# EAGLE design mae_radio_V14.05.14 (EAGLE 5.01)
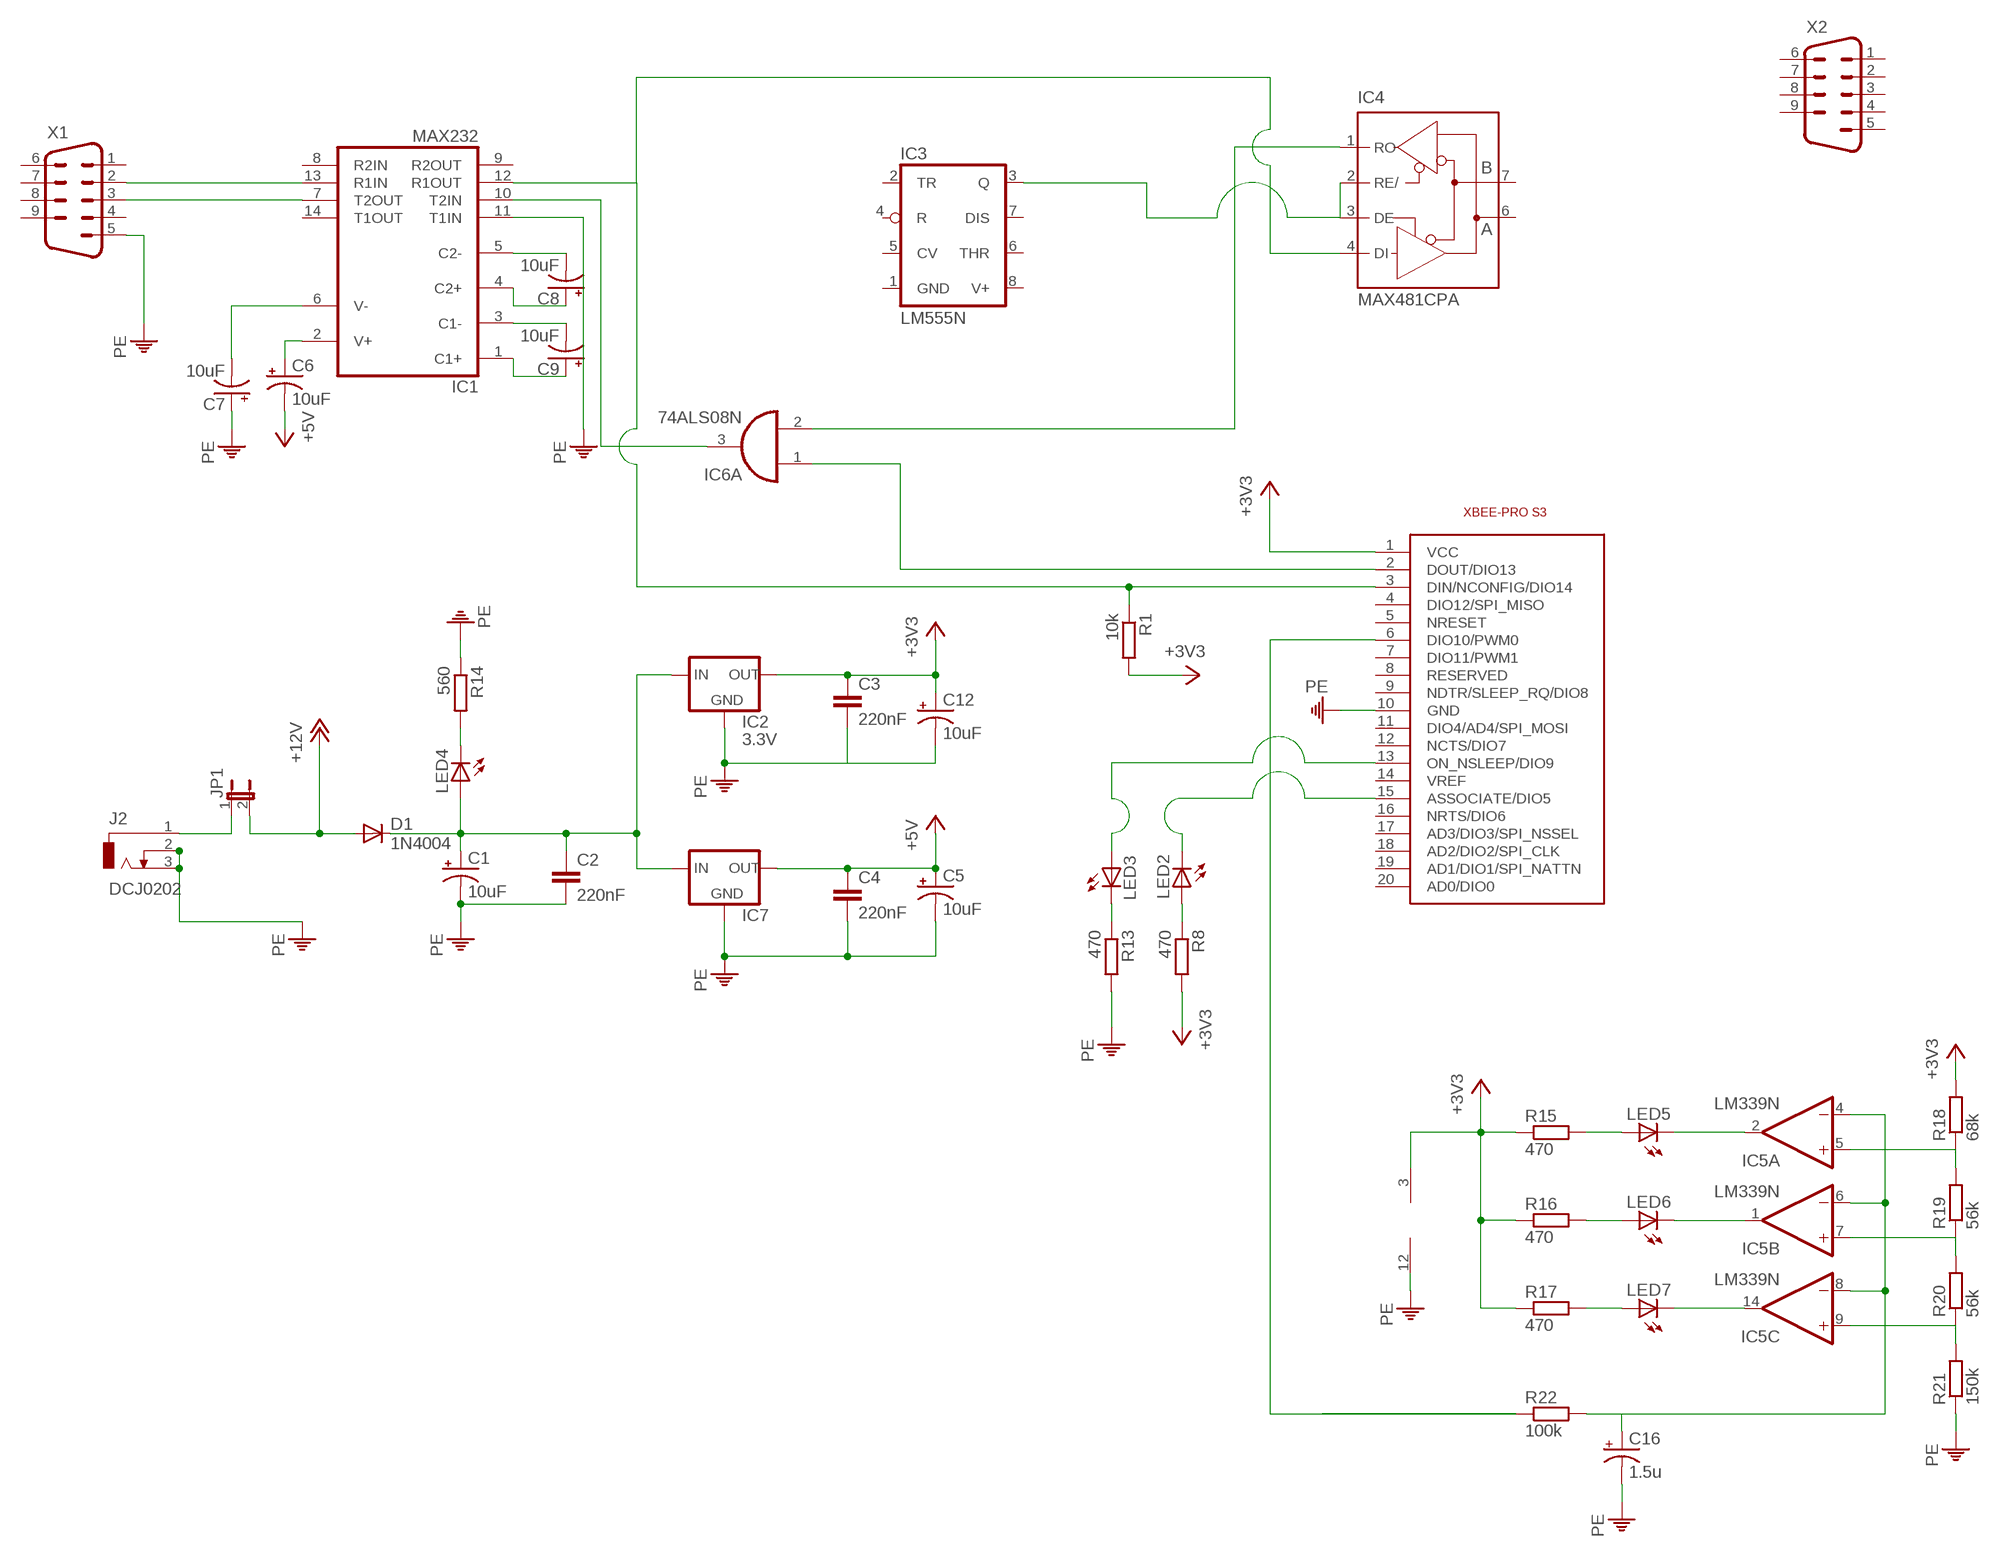
[diagram p0: schematic, sheet 1]

## Parts
C1  10uF  CPOL-USE2-5  [E2-5]
C2  220nF  C5/3.5  [C5B3.5]
C3  220nF  C5/3.5  [C5B3.5]
C4  220nF  C5/3.5  [C5B3.5]
C5  10uF  CPOL-USE2-5  [E2-5]
C6  10uF  CPOL-USE2-5  [E2-5]
C7  10uF  CPOL-USE2-5  [E2-5]
C8  10uF  CPOL-USE2-5  [E2-5]
C9  10uF  CPOL-USE2-5  [E2-5]
C12  10uF  CPOL-USE2-5  [E2-5]
C16  1.5u  CPOL-USE2-5  [E2-5]
D1  1N4004  [DO41-10]
IC1  MAX232  [DIL16]
IC2  3.3V  78XXL  [78XXL]
IC3  LM555N  [DIL08]
IC4  MAX481CPA  [DIL08]
IC5  LM339N  [DIL14]
IC6  74ALS08N  [DIL14]
IC7  78XXL  [78XXL]
J2  DCJ0202  [DCJ0202]
JP1  JP1E  [JP1]
LED2  LED3MM  [LED3MM]
LED3  LED3MM  [LED3MM]
LED4  LED5MM  [LED5MM]
LED5  LED3MM  [LED3MM]
LED6  LED3MM  [LED3MM]
LED7  LED3MM  [LED3MM]
R1  10k  R-EU_0207/7  [0207/7]
R8  470  R-EU_0207/7  [0207/7]
R13  470  R-EU_0207/7  [0207/7]
R14  560  R-EU_0207/7  [0207/7]
R15  470  R-EU_0207/7  [0207/7]
R16  470  R-EU_0207/7  [0207/7]
R17  470  R-EU_0207/7  [0207/7]
R18  68k  R-EU_0207/7  [0207/7]
R19  56k  R-EU_0207/7  [0207/7]
R20  56k  R-EU_0207/7  [0207/7]
R21  150k  R-EU_0207/7  [0207/7]
R22  100k  R-EU_0207/7  [0207/7]
U$1  XBEEPRO900  [XBEE-PRO]
X1  M09HP  [M09HP]
X2  M09HP  [M09HP]

## Nets
+3V3: C3.1 C12.+ IC2.OUT IC5.3(P:V+) R1.2 R8.2 R15.1 R16.1 R17.1 R18.2 U$1.1(VCC)
+5V: C4.1 C5.+ C6.- IC7.OUT
+12V: D1.A JP1.2
DIN: IC1.12(R1OUT) IC4.4(DI) R1.1 U$1.3(DIN/NCONFIG/DIO14)
DOUT: IC6.1(A:I0) U$1.2(DOUT/DIO13)
N$1: J2.1 JP1.1
N$2: C1.+ C2.1 D1.C IC2.IN IC7.IN LED4.A
N$3: C9.+ IC1.1(C1+)
N$4: IC1.10(T2IN) IC6.3(A:O)
N$5: IC4.1(RO) IC6.2(A:I1)
N$6: C9.- IC1.3(C1-)
N$7: C8.+ IC1.4(C2+)
N$8: LED3.A U$1.13(ON_NSLEEP/DIO9)
N$9: R22.1 U$1.6(DIO10/PWM0)
N$10: IC3.3(Q) IC4.2(RE/) IC4.3(DE)
N$11: LED2.A R8.1
N$12: C8.- IC1.5(C2-)
N$13: IC1.13(R1IN) X1.2
N$14: LED3.K(C) R13.1
N$15: LED4.K(C) R14.2
N$16: LED2.K(C) U$1.15(ASSOCIATE/DIO5)
N$17: IC1.7(T2OUT) X1.3
N$18: C7.- IC1.6(V-)
N$19: C6.+ IC1.2(V+)
N$24: IC5.2(A:OUT) LED5.K(C)
N$25: IC5.1(B:OUT) LED6.K(C)
N$26: IC5.14(C:OUT) LED7.K(C)
N$27: LED7.A R17.2
N$28: LED6.A R16.2
N$29: LED5.A R15.2
N$30: IC5.5(A:+IN) R18.1 R19.2
N$31: IC5.7(B:+IN) R19.1 R20.2
N$32: IC5.9(C:+IN) R20.1 R21.2
N$33: C16.+ IC5.4(A:-IN) IC5.6(B:-IN) IC5.8(C:-IN) R22.2
PE: C1.- C2.2 C3.2 C4.2 C5.- C7.+ C12.- C16.- IC1.11(T1IN) IC2.GND IC5.12(P:GND) IC7.GND J2.2 J2.3 R13.2 R14.1 R21.1 U$1.10(GND) X1.5
Unconnected: IC1.8(R2IN) IC1.9(R2OUT) IC1.14(T1OUT) IC3.2(TR) IC3.4(R) IC3.5(CV) IC3.6(THR) IC3.7(DIS) IC4.6(A) IC4.7(B) IC5.10(D:-IN) IC5.11(D:+IN) IC5.13(D:OUT) IC6.4(B:I0) IC6.5(B:I1) IC6.6(B:O) IC6.8(C:O) IC6.9(C:I0) IC6.10(C:I1) IC6.11(D:O) IC6.12(D:I0) IC6.13(D:I1) U$1.4(DIO12/SPI_MISO) U$1.5(NRESET) U$1.7(DIO11/PWM1) U$1.8(RESERVED) U$1.9(NDTR/SLEEP_RQ/DIO8) U$1.11(DIO4/AD4/SPI_MOSI) U$1.12(NCTS/DIO7) U$1.14(VREF) U$1.16(NRTS/DIO6) U$1.17(AD3/DIO3/SPI_NSSEL) U$1.18(AD2/DIO2/SPI_CLK) U$1.19(AD1/DIO1/SPI_NATTN) U$1.20(AD0/DIO0) X1.1 X1.4 X1.6 X1.7 X1.8 X1.9 X2.1 X2.2 X2.3 X2.4 X2.5 X2.6 X2.7 X2.8 X2.9

## Power pins joined to a net without a drawn wire
GND: IC1.15(GND) IC3.1(GND) IC4.5(GND) IC6.7(P:GND)
V+: IC3.8(V+)
VCC: IC1.16(VCC) IC4.8(VCC) IC6.14(P:VCC)

## Library data of the parts
C1 C5-C9 C12 C16 = rcl:CPOL-US: POLARIZED CAPACITOR, American symbol
C2-C4 = capacitor-wima:C: CAPACITOR naming: grid - package width
D1 = diode:1N4004: DIODE general purpose rectifier, 1 A
IC1 = maxim:MAX232: RS232 TRANSEIVER
IC2 IC7 = v-reg:78XXL: VOLTAGE REGULATOR
IC3 = linear:*555: TIMER
IC4 = maxim:MAX481CPA: RS485 TRANSEIVER
IC5 = linear:LM339: Low Power Low Offset Voltage Quad Comparators with open collector; LM139/LM239/LM339/LM2901/LM3302
IC6 = 74xx-eu:74*08: Quad 2-input AND gate
J2 = con-jack:DCJ0202: DC POWER JACK Source: DCJ0202.pdf
JP1 = jumper:JP1E: JUMPER
LED2-LED7 = led:LED: LED OSRAM: - CHIPLED LG R971, LG N971, LY N971, LG Q971, LY Q971, LO R971, LY R971 LH N974, LH R974 LS Q976, LO Q976, LY Q976 LO Q996 - Hyper CHIPLED LW Q18S LB Q993, LB Q99A, LB R99A - SideLED LS A670, LO A670, LY A670, LG A670, LP A670 LB A673, LV A673, LT A673, LW A673 LH A674 LY A675 LS A676, LA A676, LO A676, LY A676, LW A676 LS A679, LY A679, LG A679 - Hyper Micro SIDELED® LS Y876, LA Y876, LO Y876, LY Y876 LT Y87S - SmartLED LW L88C, LW L88S LB L89C, LB L89S, LG L890 LS L89K, LO L89K, LY L89K LS L896, LA L896, LO L896, LY L896 - TOPLED LS T670, LO T670, LY T670, LG T670, LP T670 LSG T670, LSP T670, LSY T670, LOP T670, LYG T670 LG T671, LOG T671, LSG T671 LB T673, LV T673, LT T673, LW T673 LH T674 LS T676, LA T676, LO T676, LY T676, LB T676, LH T676, LSB T676, LW T676 LB T67C, LV T67C, LT T67C, LS T67K, LO T67K, LY T67K, LW E67C LS E67B, LA E67B, LO E67B, LY E67B, LB E67C, LV E67C, LT E67C LW T67C LS T679, LY T679, LG T679 LS T770, LO T770, LY T770, LG T770, LP T770 LB T773, LV T773, LT T773, LW T773 LH T774 LS E675, LA E675, LY E675, LS T675 LS T776, LA T776, LO T776, LY T776, LB T776 LHGB T686 LT T68C, LB T68C - Hyper Mini TOPLED® LB M676 - Mini TOPLED Santana® LG M470 LS M47K, LO M47K, LY M47K Source: http://www.osram.convergy.de - LUMILED® LXK2-PW12-R00, LXK2-PW12-S00, LXK2-PW14-U00, LXK2-PW14-V00 LXK2-PM12-R00, LXK2-PM12-S00, LXK2-PM14-U00 LXK2-PE12-Q00, LXK2-PE12-R00, LXK2-PE12-S00, LXK2-PE14-T00, LXK2-PE14-U00 LXK2-PB12-K00, LXK2-PB12-L00, LXK2-PB12-M00, LXK2-PB14-N00, LXK2-PB14-P00, LXK2-PB14-Q00 LXK2-PR12-L00, LXK2-PR12-M00, LXK2-PR14-Q00, LXK2-PR14-R00 LXK2-PD12-Q00, LXK2-PD12-R00, LXK2-PD12-S00 LXK2-PH12-R00, LXK2-PH12-S00 LXK2-PL12-P00, LXK2-PL12-Q00, LXK2-PL12-R00 Source: www.luxeon.com
R1 R8 R13-R22 = resistor:R-EU_: RESISTOR, European symbol
U$1 = maxstream2:XBEEPRO900
X1 X2 = con-subd:M09: SUB-D

## Board
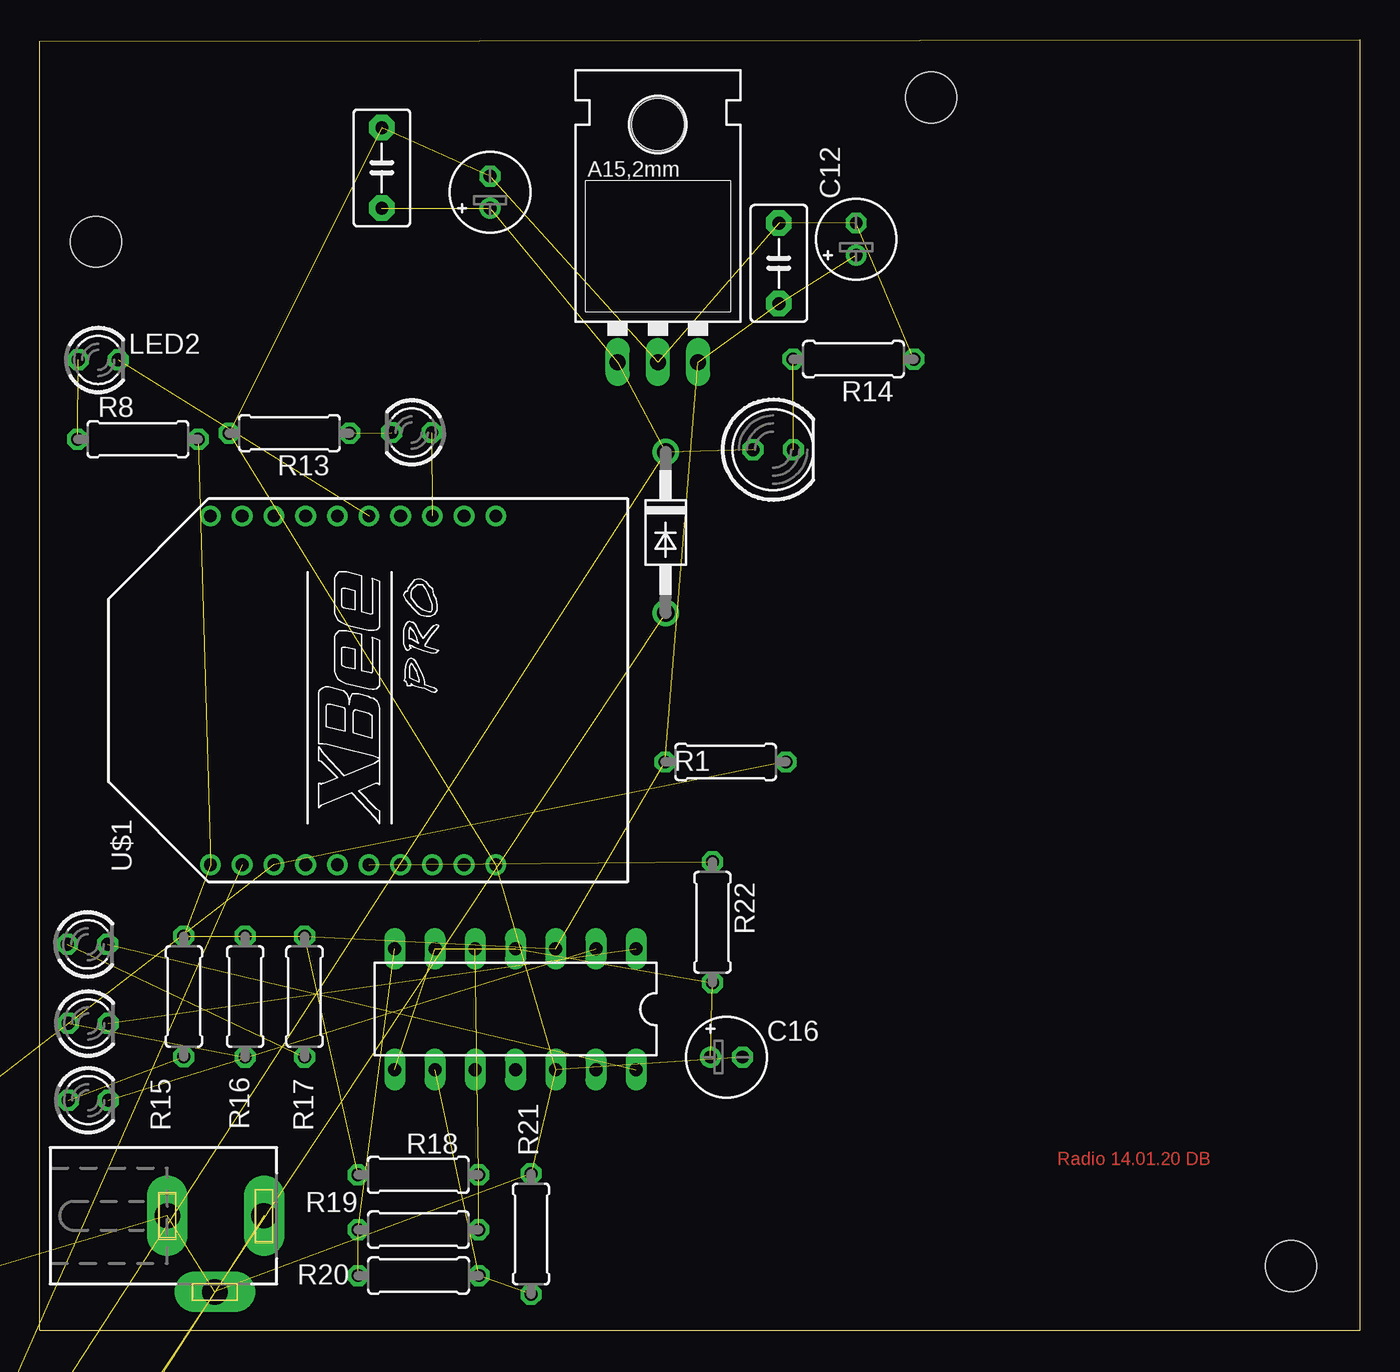
[diagram p1: board, top side]
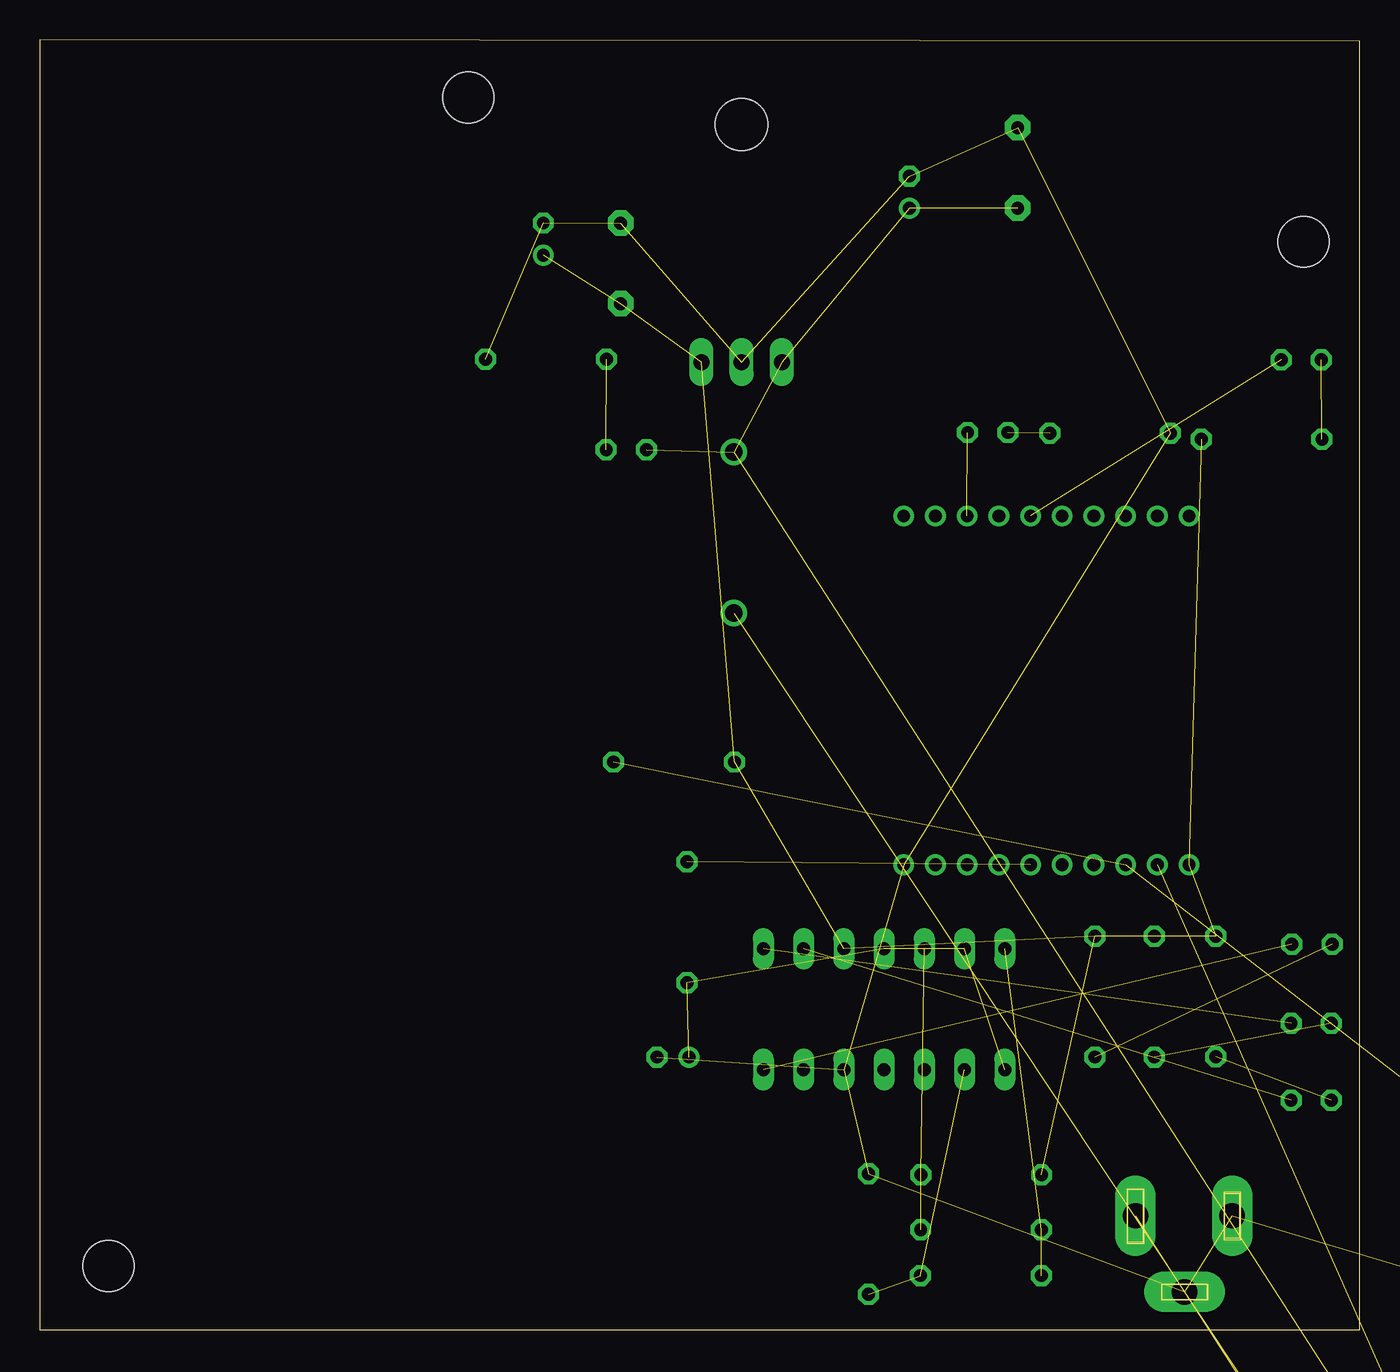
[diagram p2: board, bottom side, seen from below]

Size 83.3 x 81.4 mm. Coordinates in mm from the lower left corner, seen from the top.
Outline: 0,0 0,81.3 83.3,81.4 83.3,0 0,0
Outline: 7.5,8.7 8.6,8.7 8.6,5.7 7.5,5.7 7.5,8.7
Outline: 13.6,8.9 14.7,8.9 14.7,5.5 13.6,5.5 13.6,8.9
Outline: 9.6,1.9 12.5,1.9 12.5,2.9 9.6,2.9 9.6,1.9
Copper layers (1*16): Top 0.035mm / dielectric 1.5mm / Bottom 0.035mm
Design rules "default": minimum track width 10mil, minimum drill 24mil, track to track 8mil, track to pad 8mil, pad to pad 8mil, via to via 8mil, smd to smd 8mil, copper to edge 40mil, drill to drill 8mil, minimum pad ring 10mil, minimum via ring 8mil, stop-mask expansion 4mil, vias tented up to drill 0mil, thermal gap 10mil
Holes 3.2 mm at 78.95,4.05 56.25,77.75 3.55,68.65

### Footprints (pad centres in the part's own frame; a part is rotated, then mirrored left to right if it is on the bottom)
E2-5 = drill 0.813 pad 1.27 round: + -1.016,0 | drill 0.813 pad 1.27 octagon: - 1.016,0
C5B3.5 = drill 0.813 pad 1.6 octagon: 1 -2.54,0; 2 2.54,0
DO41-10 = drill 1.118 round: A 5.08,0; C -5.08,0
DIL16 = drill 0.813 long: 1 -8.89,-3.81; 2 -6.35,-3.81; 3 -3.81,-3.81; 4 -1.27,-3.81; 5 1.27,-3.81; 6 3.81,-3.81; 7 6.35,-3.81; 8 8.89,-3.81; 9 8.89,3.81; 10 6.35,3.81; 11 3.81,3.81; 12 1.27,3.81; 13 -1.27,3.81; 14 -3.81,3.81; 15 -6.35,3.81; 16 -8.89,3.81
78XXL = drill 1.016 long: GND 0,-3.81; IN -2.54,-3.81; OUT 2.54,-3.81 | hole 3.302: 0,11.176
DIL08 = drill 0.813 long: 1 -3.81,-3.81; 2 -1.27,-3.81; 3 1.27,-3.81; 4 3.81,-3.81; 5 3.81,3.81; 6 1.27,3.81; 7 -1.27,3.81; 8 -3.81,3.81
DIL14 = drill 0.813 long: 1 -7.62,-3.81; 2 -5.08,-3.81; 3 -2.54,-3.81; 4 0,-3.81; 5 2.54,-3.81; 6 5.08,-3.81; 7 7.62,-3.81; 8 7.62,3.81; 9 5.08,3.81; 10 2.54,3.81; 11 0,3.81; 12 -2.54,3.81; 13 -5.08,3.81; 14 -7.62,3.81
DCJ0202 = drill 1.6 pad 2.54 long: 1 0,3.1; 2 4.8,0; 3 0,-3
JP1 = drill 0.914 long: 1 0,-1.27; 2 0,1.27
LED3MM = drill 0.813 octagon: A -1.27,0; K 1.27,0
LED5MM = drill 0.813 octagon: A -1.27,0; K 1.27,0
0207/7 = drill 0.813 octagon: 1 -3.81,0; 2 3.81,0
XBEE-PRO = drill 0.8 pad 1.27 round: 1 -11,9; 2 -11,7; 3 -11,5; 4 -11,3; 5 -11,1; 6 -11,-1; 7 -11,-3; 8 -11,-5; 9 -11,-7; 10 -11,-9; 11 11,-9; 12 11,-7; 13 11,-5; 14 11,-3; 15 11,-1; 16 11,1; 17 11,3; 18 11,5; 19 11,7; 20 11,9
M09HP = drill 1.016 octagon: 1 -5.486,1.27; 2 -2.743,1.27; 3 0,1.27; 4 2.743,1.27; 5 5.486,1.27; 6 -4.115,-1.27; 7 -1.372,-1.27; 8 1.372,-1.27; 9 4.115,-1.27 | drill 3.302 pad 5.08 round: G1 -12.522,0; G2 12.522,0

### Placement (x,y rotation side)
C1  28.42,71.78 90 top
C2  21.59,73.31 90 top
C3  46.64,67.29 90 top
C4  -56.62,-106.38 0 top  (outside the outline)
C5  -57.89,-114 0 top  (outside the outline)
C6  -57.89,-120.35 0 top  (outside the outline)
C7  -57.89,-126.7 0 top  (outside the outline)
C8  -57.89,-133.05 0 top  (outside the outline)
C9  -57.89,-139.4 0 top  (outside the outline)
C12  51.52,68.82 90 top
C16  43.34,17.23 0 top
D1  39.5,50.31 270 top
IC1  -27.41,-6.05 0 top  (outside the outline)
IC2  39.01,64.87 0 top
IC3  -32.49,-69.55 0 top  (outside the outline)
IC4  -32.49,-82.25 0 top  (outside the outline)
IC5  30.02,20.25 180 top
IC6  -36.3,-94.95 0 top  (outside the outline)
IC7  -56.62,-93.68 0 top  (outside the outline)
J2  11.06,7.22 270 top
JP1  -45.19,-83.52 0 top  (outside the outline)
LED2  3.7,61.2 0 top
LED3  23.48,56.62 180 top
LED4  46.28,55.54 0 top
LED5  3.07,14.51 0 top
LED6  3.07,19.35 0 top
LED7  3.02,24.34 0 top
R1  43.28,35.84 180 top
R8  6.2,56.2 0 top
R13  15.76,56.58 180 top
R14  51.35,61.25 180 top
R15  9.1,21.05 270 top
R16  12.97,21.04 270 top
R17  16.71,21.04 270 top
R18  23.89,9.8 180 top
R19  23.9,6.35 0 top
R20  23.91,3.45 180 top
R21  31,6.07 270 top
R22  42.45,25.73 270 top
U$1  19.78,40.36 90 top
X1  -23.6,-20.02 0 top  (outside the outline)
X2  -23.6,-45.42 0 top  (outside the outline)

### Tracks (layer width: path | path; a pad name or v marks a point on that pad's centre or on a via)
+3V3  (10 unrouted)
+5V  (3 unrouted)
+12V  (1 unrouted)
DIN  (3 unrouted)
DOUT  (1 unrouted)
GND  (3 unrouted)
N$1  (1 unrouted)
N$2  (5 unrouted)
N$3  (1 unrouted)
N$4  (1 unrouted)
N$5  (1 unrouted)
N$6  (1 unrouted)
N$7  (1 unrouted)
N$8  (1 unrouted)
N$9  (1 unrouted)
N$10  (2 unrouted)
N$11  (1 unrouted)
N$12  (1 unrouted)
N$13  (1 unrouted)
N$14  (1 unrouted)
N$15  (1 unrouted)
N$16  (1 unrouted)
N$17  (1 unrouted)
N$18  (1 unrouted)
N$19  (1 unrouted)
N$24  (1 unrouted)
N$25  (1 unrouted)
N$26  (1 unrouted)
N$27  (1 unrouted)
N$28  (1 unrouted)
N$29  (1 unrouted)
N$30  (2 unrouted)
N$31  (2 unrouted)
N$32  (2 unrouted)
N$33  (4 unrouted)
PE  (18 unrouted)
  pour Bottom (isolate 0.406): -22.1,43.3 -33.2,69.3 -41.2,8.8 -24.8,19
VCC  (2 unrouted)

### Text on the board
Top: Radio 14.01.20 DB